# Altium schematic sheet MidDin.SchDoc
size A4
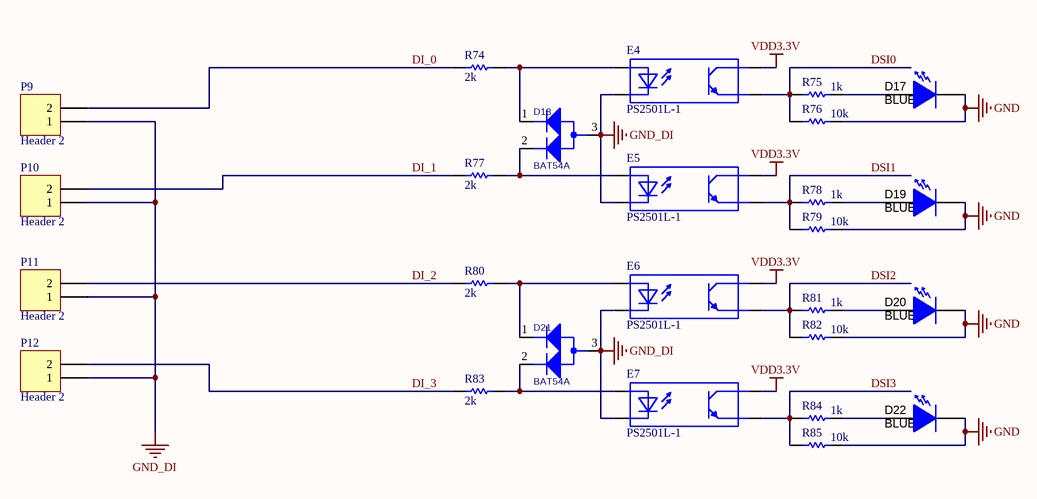
[diagram p0: MidDin.SchDoc]

## Parts
D17  value BLUE  [D0805]  (hidden comment: SML-P12YTT86)
D18  BAT54A  [SOT23]
D19  value BLUE  [D0805]  (hidden comment: SML-P12YTT86)
D20  value BLUE  [D0805]  (hidden comment: SML-P12YTT86)
D21  BAT54A  [SOT23]
D22  value BLUE  [D0805]  (hidden comment: SML-P12YTT86)
E4  PS2501L-1  [NEC2501]
E5  PS2501L-1  [NEC2501]
E6  PS2501L-1  [NEC2501]
E7  PS2501L-1  [NEC2501]
P9  Header 2  [3.5-P2]
P10  Header 2  [3.5-P2]
P11  Header 2  [3.5-P2]
P12  Header 2  [3.5-P2]
R74  value 2k  [0805]  (hidden comment: Res Semi)
R75  value 1k  [0805]  (hidden comment: Res Semi)
R76  value 10k  [0805]  (hidden comment: Res Semi)
R77  value 2k  [0805]  (hidden comment: Res Semi)
R78  value 1k  [0805]  (hidden comment: Res Semi)
R79  value 10k  [0805]  (hidden comment: Res Semi)
R80  value 2k  [0805]  (hidden comment: Res Semi)
R81  value 1k  [0805]  (hidden comment: Res Semi)
R82  value 10k  [0805]  (hidden comment: Res Semi)
R83  value 2k  [0805]  (hidden comment: Res Semi)
R84  value 1k  [0805]  (hidden comment: Res Semi)
R85  value 10k  [0805]  (hidden comment: Res Semi)

## Nets
GND: D17.2(K) D19.2(K) D20.2(K) D22.2(K) R76.2 R79.2 R82.2 R85.2
GND_DI: D18.3 D21.3 E4.2 E5.2 E6.2 E7.2 P9.1 P10.1 P11.1 P12.1
VDD3.3V: E4.4 E5.4 E6.4 E7.4
DI_0: P9.2 R74.1
DI_1: P10.2 R77.1
DI_2: P11.2 R80.1
DI_3: P12.2 R83.1
DSI0: E4.3 R75.1 R76.1
DSI1: E5.3 R78.1 R79.1
DSI2: E6.3 R81.1 R82.1
DSI3: E7.3 R84.1 R85.1
NetD17_1: D17.1(A) R75.2
NetD18_1: D18.1 E4.1 R74.2
NetD18_2: D18.2 E5.1 R77.2
NetD19_1: D19.1(A) R78.2
NetD20_1: D20.1(A) R81.2
NetD21_1: D21.1 E6.1 R80.2
NetD21_2: D21.2 E7.1 R83.2
NetD22_1: D22.1(A) R84.2

## Library data of the parts
D17 D19 D20 D22 = SML-P12YTT86: LED, GREEN SMD; Manufacturer: Rohm; Type: InGaN; Vf_V: 2.1; Value2: 2.1V; Io_A: 0.02; Tjmax_C: 85; Value1: W; Color: yellow; U/M: EA; CompType: LED; PartNumber: SML-P12YTT86; SymbolVersion: 2008-12-08; MountType: SMT; RoHS: Y; PackageReference: Yellow LED; Published: 2008-07-11; Publisher: Texas Instruments; ComponentLink1URL: http://rohmfs.rohm.com/en/products/databook/datasheet/opto/led/chip_mono/sml-p1.pdf; ComponentLink1Description: Datasheet link; LatestRevisionDate: 2013-06-24; LatestRevisionNote: Updated supplier queries; Supplier 1: Digi-Key; Supplier Part Number 1: 511-1595-1-ND; Supplier 2: Mouser; Supplier Part Number 2: 755-SML-P12YTT86; Supplier 3: Farnell; Supplier Part Number 3: 1973107
D18 D21 = BAT54A/SOT_2: PCB Footprint SMD: SMD; SMT: Y; TOLERANCE: =D22_TOLERANCE
E4-E7 = O: 光耦
P9-P12 = Header 2: Header, 2-Pin; LatestRevisionDate: 17-Jul-2002; LatestRevisionNote: Re-released for DXP Platform.; Publisher: Altium Limited
R74-R85 = Res Semi: Semiconductor Resistor; Published: 8-Jun-2000; LatestRevisionDate: 17-Jul-2002; LatestRevisionNote: Re-released for DXP Platform.; PackageReference: AXIAL-0.5; Publisher: Altium Limited